# Altium schematic sheet Switch Matrix.SchDoc
size A3
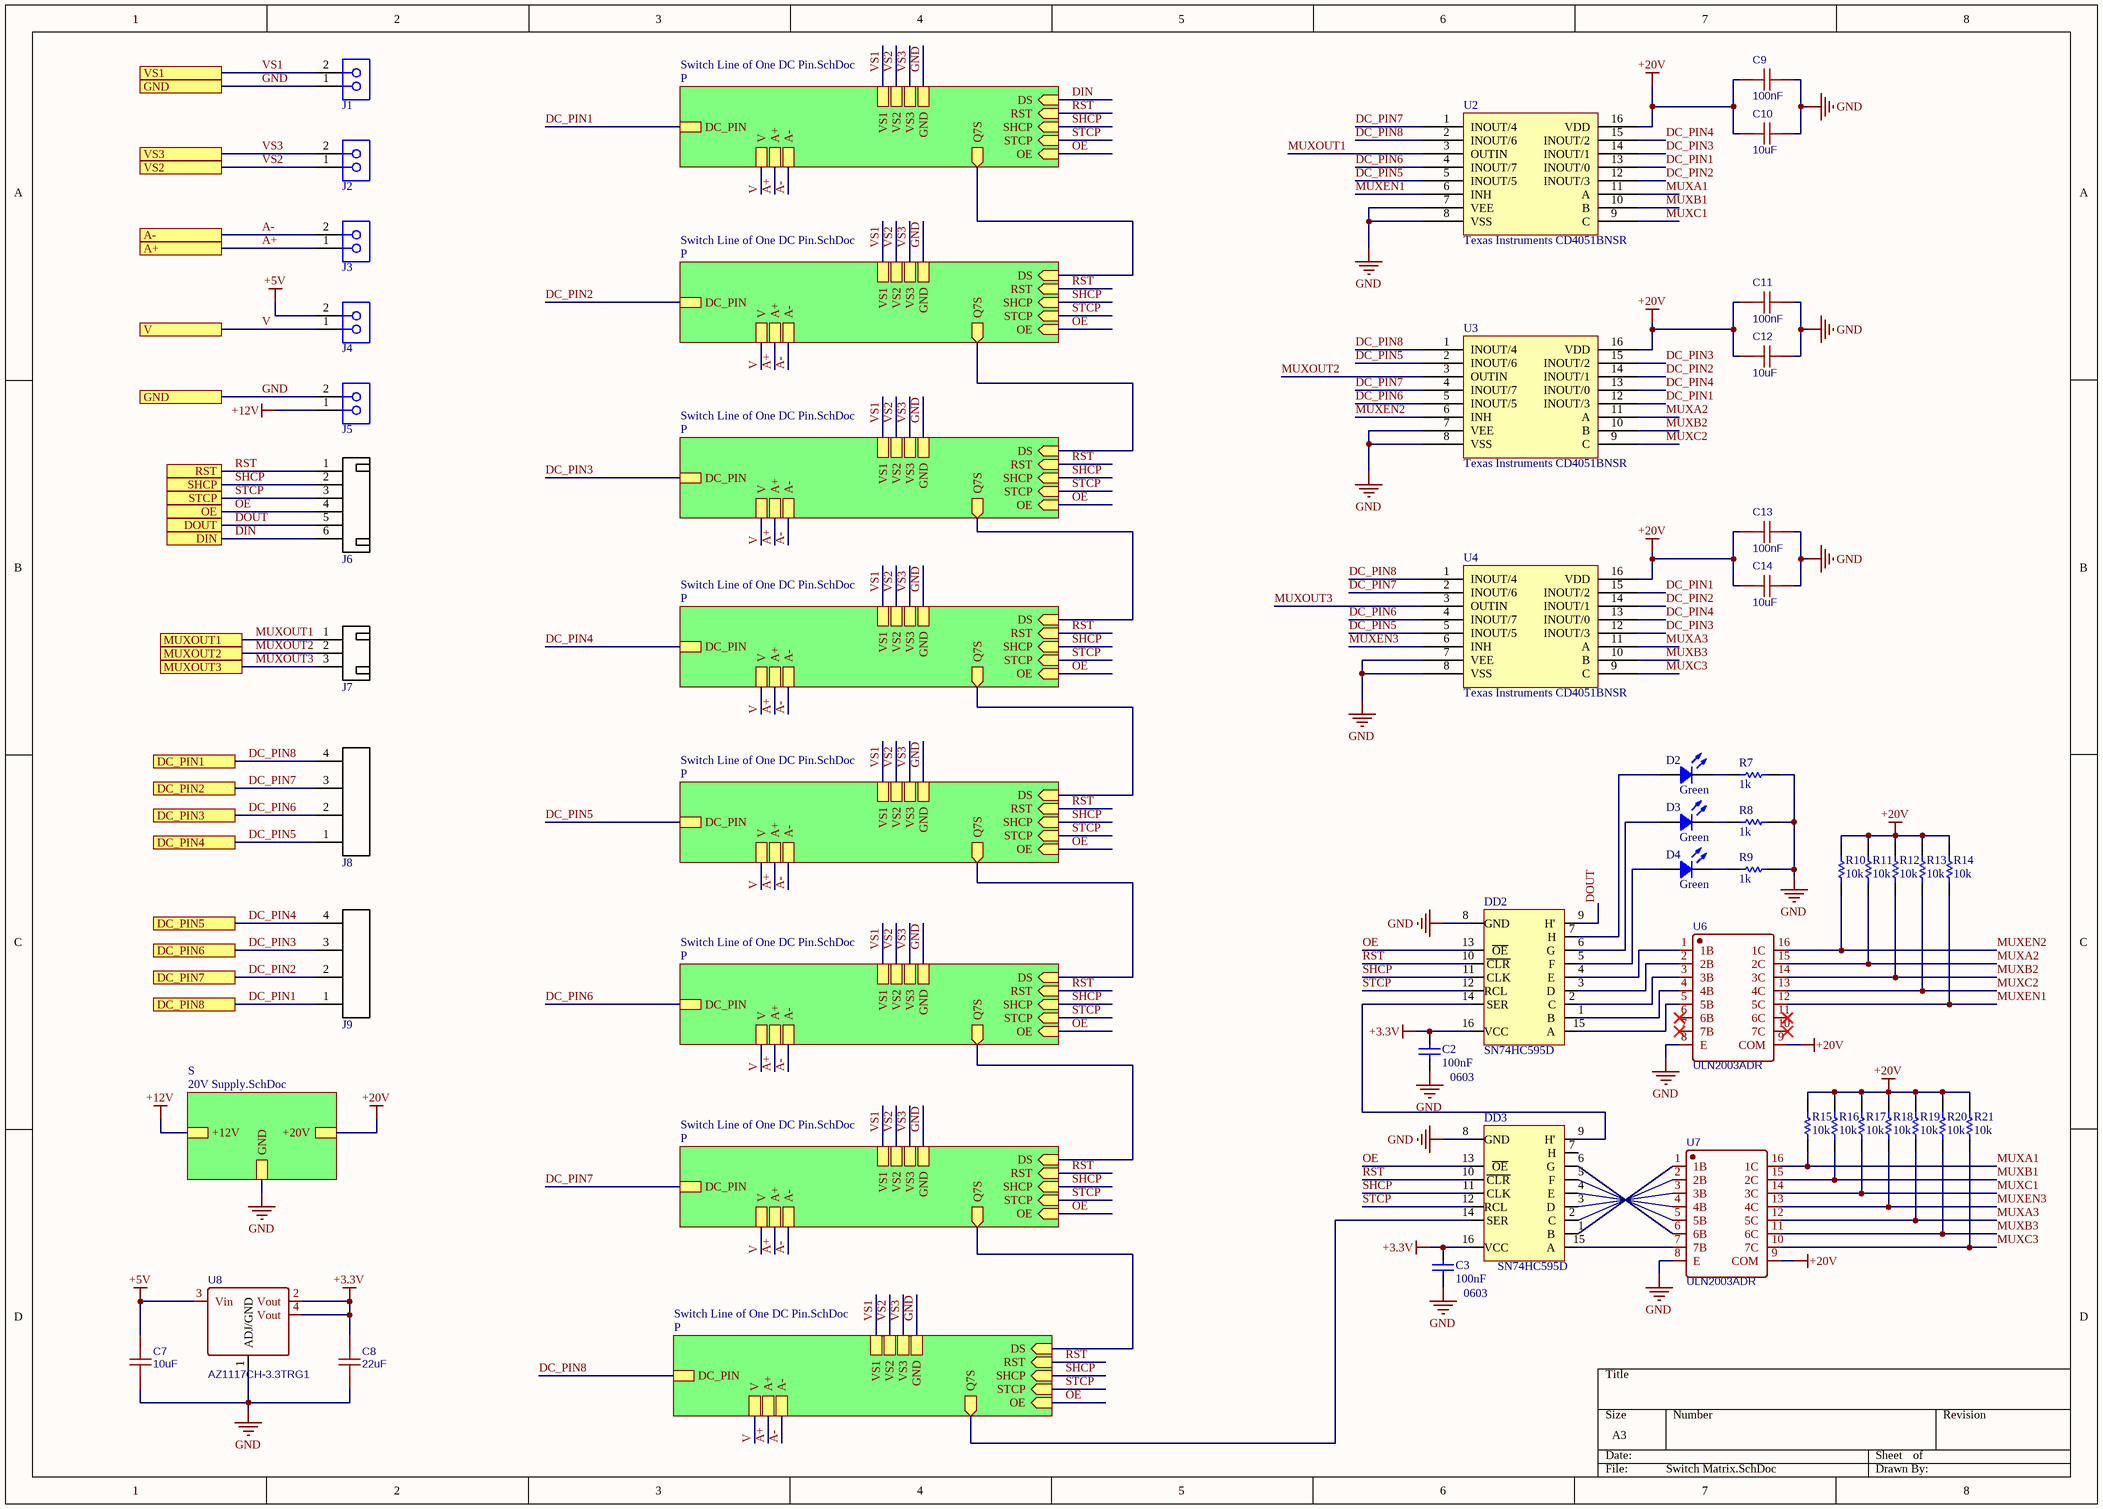
[diagram p0: Switch Matrix.SchDoc]

## Parts
C2  100nF  Package / Case: 0603  [CAPC1608X09N]
C3  100nF  Package / Case: 0603  [CAPC1608X09N]
C7  10uF  [C0805]
C8  22uF  [C0603]
C9  100nF  [C0603]
C10  10uF  [C0805]
C11  100nF  [C0603]
C12  10uF  [C0805]
C13  100nF  [C0603]
C14  10uF  [C0805]
D2  Green  [LED 0603_1608 GREEN]
D3  Green  [LED 0603_1608 GREEN]
D4  Green  [LED 0603_1608 GREEN]
DD2  SN74HC595D  [PCB-72k1vk0k27b6qyyenbg0-1]
DD3  SN74HC595D  [PCB-72k1vk0k27b6qyyenbg0-1]
J1  DB126V-5.0-2P-GN  [PCB-kiok1jlp9o9fcwf1wwvf-1]  (value not drawn)
J2  DB126V-5.0-2P-GN  [PCB-kiok1jlp9o9fcwf1wwvf-1]  (value not drawn)
J3  DB126V-5.0-2P-GN  [PCB-kiok1jlp9o9fcwf1wwvf-1]  (value not drawn)
J4  DB126V-5.0-2P-GN  [PCB-kiok1jlp9o9fcwf1wwvf-1]  (value not drawn)
J5  DB126V-5.0-2P-GN  [PCB-kiok1jlp9o9fcwf1wwvf-1]  (value not drawn)
J6  JST S6B-XH-A  [JST S6B-XH-A]  (value not drawn)
J7  CN-1P-M-R3  [JST-S3B-XH-A(LF)(SN)_V]  (value not drawn)
J8  JST B4PS-VH(LF)(SN)  [PCB-fv0n1qe7e7tw0owzte2c-1]  (value not drawn)
J9  JST B4PS-VH(LF)(SN)  [PCB-fv0n1qe7e7tw0owzte2c-1]  (value not drawn)
R7  1k  [gen0603-2]
R8  1k  [gen0603-2]
R9  1k  [gen0603-2]
R10  10k  [gen0603-2]
R11  10k  [gen0603-2]
R12  10k  [gen0603-2]
R13  10k  [gen0603-2]
R14  10k  [gen0603-2]
R15  10k  [gen0603-2]
R16  10k  [gen0603-2]
R17  10k  [gen0603-2]
R18  10k  [gen0603-2]
R19  10k  [gen0603-2]
R20  10k  [gen0603-2]
R21  10k  [gen0603-2]
U2  Texas Instruments CD4051BNSR  [PCB-xp4qbii5l2bbflfsgoli-1]
U3  Texas Instruments CD4051BNSR  [PCB-xp4qbii5l2bbflfsgoli-1]
U4  Texas Instruments CD4051BNSR  [PCB-xp4qbii5l2bbflfsgoli-1]
U6  ULN2003ADR  [SOIC-16_L9.9-W3.9-P1.27-LS6.0-BL]
U7  ULN2003ADR  [SOIC-16_L9.9-W3.9-P1.27-LS6.0-BL]
U8  AZ1117CH-3.3TRG1  [SOT-223-3_L6.5-W3.4-P2.30-LS7.0-BR]

## Sub-sheets
P = Switch Line of One DC Pin.SchDoc: DC_PIN, STCP (in), SHCP (in), Q7S (out), VS2, OE (in), VS1, RST (in), VS3, DS (in), GND, A+, A-, V
P = Switch Line of One DC Pin.SchDoc: DC_PIN, STCP (in), SHCP (in), Q7S (out), VS2, OE (in), VS1, RST (in), VS3, DS (in), GND, A+, A-, V
P = Switch Line of One DC Pin.SchDoc: DC_PIN, STCP (in), SHCP (in), Q7S (out), VS2, OE (in), VS1, RST (in), VS3, DS (in), GND, A+, A-, V
P = Switch Line of One DC Pin.SchDoc: DC_PIN, STCP (in), SHCP (in), Q7S (out), VS2, OE (in), VS1, RST (in), VS3, DS (in), GND, A+, A-, V
P = Switch Line of One DC Pin.SchDoc: DC_PIN, STCP (in), SHCP (in), Q7S (out), VS2, OE (in), VS1, RST (in), VS3, DS (in), GND, A+, A-, V
P = Switch Line of One DC Pin.SchDoc: DC_PIN, STCP (in), SHCP (in), Q7S (out), VS2, OE (in), VS1, RST (in), VS3, DS (in), GND, A+, A-, V
P = Switch Line of One DC Pin.SchDoc: DC_PIN, STCP (in), SHCP (in), Q7S (out), VS2, OE (in), VS1, RST (in), VS3, DS (in), GND, A+, A-, V
P = Switch Line of One DC Pin.SchDoc: DC_PIN, STCP (in), SHCP (in), Q7S (out), VS2, OE (in), VS1, RST (in), VS3, DS (in), GND, A+, A-, V
S = 20V Supply.SchDoc: +20V, +12V, GND

## Ports
A+, A-, DC_PIN1, DC_PIN2, DC_PIN3, DC_PIN4, DC_PIN5, DC_PIN6, DC_PIN7, DC_PIN8, DIN, DOUT, GND, MUXOUT1, MUXOUT2, MUXOUT3, OE, RST, SHCP, STCP, V, VS1, VS2, VS3

## Nets
+3.3V: C2.2 C3.2 C8.2 DD2.16(VCC) DD3.16(VCC) U8.2(Vout) U8.4(Vout)
+5V: C7.2 J4.2 U8.3(Vin)
+12V: J5.1 ; sheet S/+12V
+20V: C9.1 C10.2 C11.1 C12.2 C13.1 C14.2 R10.2 R11.2 R12.2 R13.2 R14.2 R15.2 R16.2 R17.2 R18.2 R19.2 R20.2 R21.2 U2.16(VDD) U3.16(VDD) U4.16(VDD) U6.9(COM) U7.9(COM) ; sheet S/+20V
GND: C2.1 C3.1 C7.1 C8.1 C9.2 C10.1 C11.2 C12.1 C13.2 C14.1 DD2.8(GND) DD3.8(GND) J1.1 J5.2 R7.1 R8.1 R9.1 U2.7(VEE) U2.8(VSS) U3.7(VEE) U3.8(VSS) U4.7(VEE) U4.8(VSS) U6.8(E) U7.8(E) U8.1(ADJ/GND) ; port GND, sheet P/GND, sheet P/GND, sheet P/GND, sheet P/GND, sheet P/GND, sheet P/GND, sheet P/GND, sheet P/GND, sheet S/GND
A+: J3.1 ; port A+, sheet P/A+, sheet P/A+, sheet P/A+, sheet P/A+, sheet P/A+, sheet P/A+, sheet P/A+, sheet P/A+
A-: J3.2 ; port A-, sheet P/A-, sheet P/A-, sheet P/A-, sheet P/A-, sheet P/A-, sheet P/A-, sheet P/A-, sheet P/A-
DC_PIN1: J9.1 U2.13(INOUT/0) U3.12(INOUT/3) U4.15(INOUT/2) ; port DC_PIN8, sheet P/DC_PIN
DC_PIN2: J9.2 U2.12(INOUT/3) U3.14(INOUT/1) U4.14(INOUT/1) ; port DC_PIN7, sheet P/DC_PIN
DC_PIN3: J9.3 U2.14(INOUT/1) U3.15(INOUT/2) U4.12(INOUT/3) ; port DC_PIN6, sheet P/DC_PIN
DC_PIN4: J9.4 U2.15(INOUT/2) U3.13(INOUT/0) U4.13(INOUT/0) ; port DC_PIN5, sheet P/DC_PIN
DC_PIN5: J8.1 U2.5(INOUT/5) U3.2(INOUT/6) U4.5(INOUT/5) ; port DC_PIN4, sheet P/DC_PIN
DC_PIN6: J8.2 U2.4(INOUT/7) U3.5(INOUT/5) U4.4(INOUT/7) ; port DC_PIN3, sheet P/DC_PIN
DC_PIN7: J8.3 U2.1(INOUT/4) U3.4(INOUT/7) U4.2(INOUT/6) ; port DC_PIN2, sheet P/DC_PIN
DC_PIN8: J8.4 U2.2(INOUT/6) U3.1(INOUT/4) U4.1(INOUT/4) ; port DC_PIN1, sheet P/DC_PIN
DIN: J6.6 ; port DIN, sheet P/DS
DOUT: DD2.9(H') J6.5 ; port DOUT
MUXA1: R15.1 U2.11(A) U7.16(1C)
MUXA2: R11.1 U3.11(A) U6.15(2C)
MUXA3: R19.1 U4.11(A) U7.12(5C)
MUXB1: R16.1 U2.10(B) U7.15(2C)
MUXB2: R12.1 U3.10(B) U6.14(3C)
MUXB3: R20.1 U4.10(B) U7.11(6C)
MUXC1: R17.1 U2.9(C) U7.14(3C)
MUXC2: R13.1 U3.9(C) U6.13(4C)
MUXC3: R21.1 U4.9(C) U7.10(7C)
MUXEN1: R14.1 U2.6(INH) U6.12(5C)
MUXEN2: R10.1 U3.6(INH) U6.16(1C)
MUXEN3: R18.1 U4.6(INH) U7.13(4C)
MUXOUT1: J7.1 U2.3(OUTIN) ; port MUXOUT1
MUXOUT2: J7.2 U3.3(OUTIN) ; port MUXOUT2
MUXOUT3: J7.3 U4.3(OUTIN) ; port MUXOUT3
OE: DD2.13(~{OE}) DD3.13(~{OE}) J6.4 ; port OE, sheet P/OE, sheet P/OE, sheet P/OE, sheet P/OE, sheet P/OE, sheet P/OE, sheet P/OE, sheet P/OE
RST: DD2.10(~{CLR}) DD3.10(~{CLR}) J6.1 ; port RST, sheet P/RST, sheet P/RST, sheet P/RST, sheet P/RST, sheet P/RST, sheet P/RST, sheet P/RST, sheet P/RST
SHCP: DD2.11(CLK) DD3.11(CLK) J6.2 ; port SHCP, sheet P/SHCP, sheet P/SHCP, sheet P/SHCP, sheet P/SHCP, sheet P/SHCP, sheet P/SHCP, sheet P/SHCP, sheet P/SHCP
STCP: DD2.12(RCL) DD3.12(RCL) J6.3 ; port STCP, sheet P/STCP, sheet P/STCP, sheet P/STCP, sheet P/STCP, sheet P/STCP, sheet P/STCP, sheet P/STCP, sheet P/STCP
V: J4.1 ; port V, sheet P/V, sheet P/V, sheet P/V, sheet P/V, sheet P/V, sheet P/V, sheet P/V, sheet P/V
VS1: J1.2 ; port VS1, sheet P/VS1, sheet P/VS1, sheet P/VS1, sheet P/VS1, sheet P/VS1, sheet P/VS1, sheet P/VS1, sheet P/VS1
VS2: J2.1 ; port VS2, sheet P/VS2, sheet P/VS2, sheet P/VS2, sheet P/VS2, sheet P/VS2, sheet P/VS2, sheet P/VS2, sheet P/VS2
VS3: J2.2 ; port VS3, sheet P/VS3, sheet P/VS3, sheet P/VS3, sheet P/VS3, sheet P/VS3, sheet P/VS3, sheet P/VS3, sheet P/VS3
NetD2_1: D2.1 DD2.7(H)
NetD2_2: D2.2 R7.2
NetD3_1: D3.1 DD2.6(G)
NetD3_2: D3.2 R8.2
NetD4_1: D4.1 DD2.5(F)
NetD4_2: D4.2 R9.2
NetDD2_1: DD2.1(B) U6.4(4B)
NetDD2_2: DD2.2(C) U6.3(3B)
NetDD2_3: DD2.3(D) U6.2(2B)
NetDD2_4: DD2.4(E) U6.1(1B)
NetDD2_14: DD2.14(SER) DD3.9(H')
NetDD2_15: DD2.15(A) U6.5(5B)
NetDD3_1: DD3.1(B) U7.1(1B)
NetDD3_2: DD3.2(C) U7.2(2B)
NetDD3_3: DD3.3(D) U7.3(3B)
NetDD3_4: DD3.4(E) U7.4(4B)
NetDD3_5: DD3.5(F) U7.5(5B)
NetDD3_6: DD3.6(G) U7.6(6B)
NetDD3_14: DD3.14(SER) ; sheet P/Q7S
NetDD3_15: DD3.15(A) U7.7(7B)
(unnamed): sheet P/DS, sheet P/Q7S
(unnamed): sheet P/DS, sheet P/Q7S
(unnamed): sheet P/DS, sheet P/Q7S
(unnamed): sheet P/DS, sheet P/Q7S
(unnamed): sheet P/DS, sheet P/Q7S
(unnamed): sheet P/DS, sheet P/Q7S
(unnamed): sheet P/DS, sheet P/Q7S

Not connected (* = marked no-connect by the designer): DD3 7(H); U6 6(6B)* 7(7B)* 10(7C)* 11(6C)*

## Library data of the parts
C2 C3 = CMP-2f55e5122ad9f092-5: 0603 10 nF 50 V ± 10% Tolerance X7R Surface Mount Multilayer Ceramic Capacitor; Manufacture Part Number: CC0603KRX7R9BB104; Manufacturer: YAGEO; Voltage-Rated: 50V; Capacitance Tolerance: 10%; Capacitance: 100nF; Supplier: LCSC; Supplier Part Number: C14663
C7 C10 C12 C14 = 10uF: Manufacture Part Number: CL21B106KOQNNNE; Manufacturer: SAMSUNG; nameAlias: Capacitance; spicePre: C; spiceSymbolName: CL21B106KOQNNNE; Supplier: LCSC; Supplier Part Number: C95841
C8 = 22uF: Manufacture Part Number: CL10A226MP8NUNE; Manufacturer: SAMSUNG; nameAlias: Capacitance; SMT Type: Extend; BOM_LCSC Assembly: Yes; spicePre: C; spiceSymbolName: CL10A226MP8NUNE; Supplier: LCSC; Supplier Part Number: C86295
C9 C11 C13 = 100nF: Manufacture Part Number: CC0603KRX7R9BB104; Manufacturer: YAGEO; nameAlias: Capacitance; SMT Type: Basic; BOM_LCSC Assembly: Yes; spicePre: C; spiceSymbolName: CC0603KRX7R9BB104; Supplier: LCSC; Supplier Part Number: C14663
D2-D4 = TLMG1100-GS08: LED GREEN 0603 SMD; Manufacturer: Orient; Manufacture Part Number: ORH-G36G; Forward Voltage: 2.8V; Color: Green; ComponentLink1Description: Datasheet; ComponentLink1URL: http://www.vishay.com/docs/83173/tlmb1100.pdf; ComponentLink2Description: DigiKey Link; ComponentLink2URL: http://digikey.com/product-detail/en/vishay-semiconductor-opto-division/TLMG1100-GS08/751-1165-1-ND/1681448; Supplier: LCSC; Supplier Part Number: C205443
DD2 DD3 = CMP-ded317d957220114-5: Shift Register Single 8-Bit Serial to Serial/Parallel 16-Pin SOIC Tube; Manufacture Part Number: 74HC595D,118; Manufacturer: Nexperia; Supplier: LCSC; Supplier Part Number: C5947; Package / Case: SOIC-16_150mil
J1-J5 = CMP-7ad9b3d37ed8a51e-5: Block, Terminal; 13.5 A; 250 V; 5 mm; 26 to 16 AWG; 2; Screw; Solder; 4 kV; PA; Manufacturer: DIBO; Pin pitch: 5.0mm; Manufacture Part Number: DB126V-5.0-2P-GN; Supplier: LCSC; Supplier Part Number: C395849
J6 = CMP-239aeae271c2fc5d-12: Socket; wire-board; male; PIN: 6; 2.5mm; THT; XH; 250V; 3A; -25÷85°C; Manufacturer: JST Sales America; Manufacture Part Number: S6B-XH-A(LF)(SN); Lead-Free Status: Lead Free; Voltage Rating (AC): 250 V; Orientation: Right Angle; Supplier: LCSC; Supplier Part Number: C157919
J7 = CMP-656568-19: Male Header, Pitch 2.5 mm, 1 x 3 Position, Height 6.1 mm, Tail Length 3.4 mm, -25 to 85 degC, RoHS, Bulk; Manufacture Part Number: S3B-XH-A(LF)(SN); Manufacturer: JST Sales America; Number of Contacts: 3; Current Rating: 3.00 A; Lead-Free Status: Lead Free; Insulation Resistance: 1.00 GΩ; RoHS: Compliant; PackageDescription: Male Header, Pitch 2.5 mm, 1 x 3 Position, Height 6.1 mm, Tail Length 3.4 mm; Gender: Male; Mounting Style: Through Hole; PackageReference: S3B-XH-A(LF)(SN); Supplier Part Number: C157928; Supplier: LCSC
J8 J9 = CMP-324efb47dcc6ed89-6: Connector Header, VH Series, 4 Position, 3.96mm, 250V, 22-16 AWG, Side Entry, Natural; Manufacture Part Number: B8PS-VH(LF)(SN); Manufacturer: JST Sales America; Current Rating: 7.00 A; Pin Pitch: 3.96 mm; Supplier: LCSC; Supplier Part Number: C157970
R7-R9 = CMP-1853278-27: Manufacture Part Number: RC0603FR-071KL; Manufacturer: YAGEO; Resistance Tolerance: 1%; Supplier: LCSC; Supplier Part Number: C22548; Resistance: 1k; Package / Case: 0603
R10-R21 = CMP-1853278-27: Manufacture Part Number: RC0603FR-0710KL; Manufacturer: YAGEO; Resistance Tolerance: 1%; Supplier: LCSC; Supplier Part Number: C98220; Resistance: 10k; Package / Case: 0603
U2-U4 = CMP-7a8fb3826b5da548-1: 20-V, 8: 1, 1-channel analog multiplexer with logic-level conversion 16-SO -55 to 125; Bandwidth: 20.0 MHz; Lead-Free Status: Lead Free; Number of Bits: 8; Number of Circuits: 1; Polarity: Non-Inverting; Propagation Delay Max (tpd): 20.0 ns; Quiescent Current: 80.0 nA; Supply Current: 100 µA; Supply Voltage (DC): 15.0 V; Voltage Nodes: 10.0 V, 5.00 V, 15.0 V; Octopart URL: https://octopart.com/cd4051bnsr-texas+instruments-472244; Case/Package: PDIP, SOIC, SOP; Lifecycle Status: Active; Mounting Style: Surface Mount; Number of Channels: 8; Operating Temperature: -55.0 °C to 125 °C; Packaging: SOIC-16_208mil; Number of Pins: 16; RoHS: Compliant; OctopartID: 7a8fb3826b5da548; Supplier Part Number: C87646; Supplier: LCSC; Manufacture Part Number: CD4051BNSR; Manufacturer: Texas Instruments
U6 U7 = ULN2003ADR: Manufacturer: TI; SMT Type: Basic; spicePre: X; image: //image.lceda.cn/szlcsc/C7512.jpg; BOM_LCSC Assembly: Yes; spiceSymbolName: ULN2003ADR; Manufacture Part Number: ULN2003ADR; Supplier: LCSC; Supplier Part Number: C7512
U8 = AZ1117CH-3.3TRG1: Manufacturer: DIODES; SMT Type: Extend; BOM_LCSC Assembly: Yes; spicePre: U; spiceSymbolName: AZ1117CH-3.3TRG1; Manufacture Part Number: AZ1117CH-3.3TRG1; Supplier: LCSC; Supplier Part Number: C92102